# Altium schematic sheet Microcontroller.SchDoc
size A; SheetNumber: 6; SheetTotal: 6
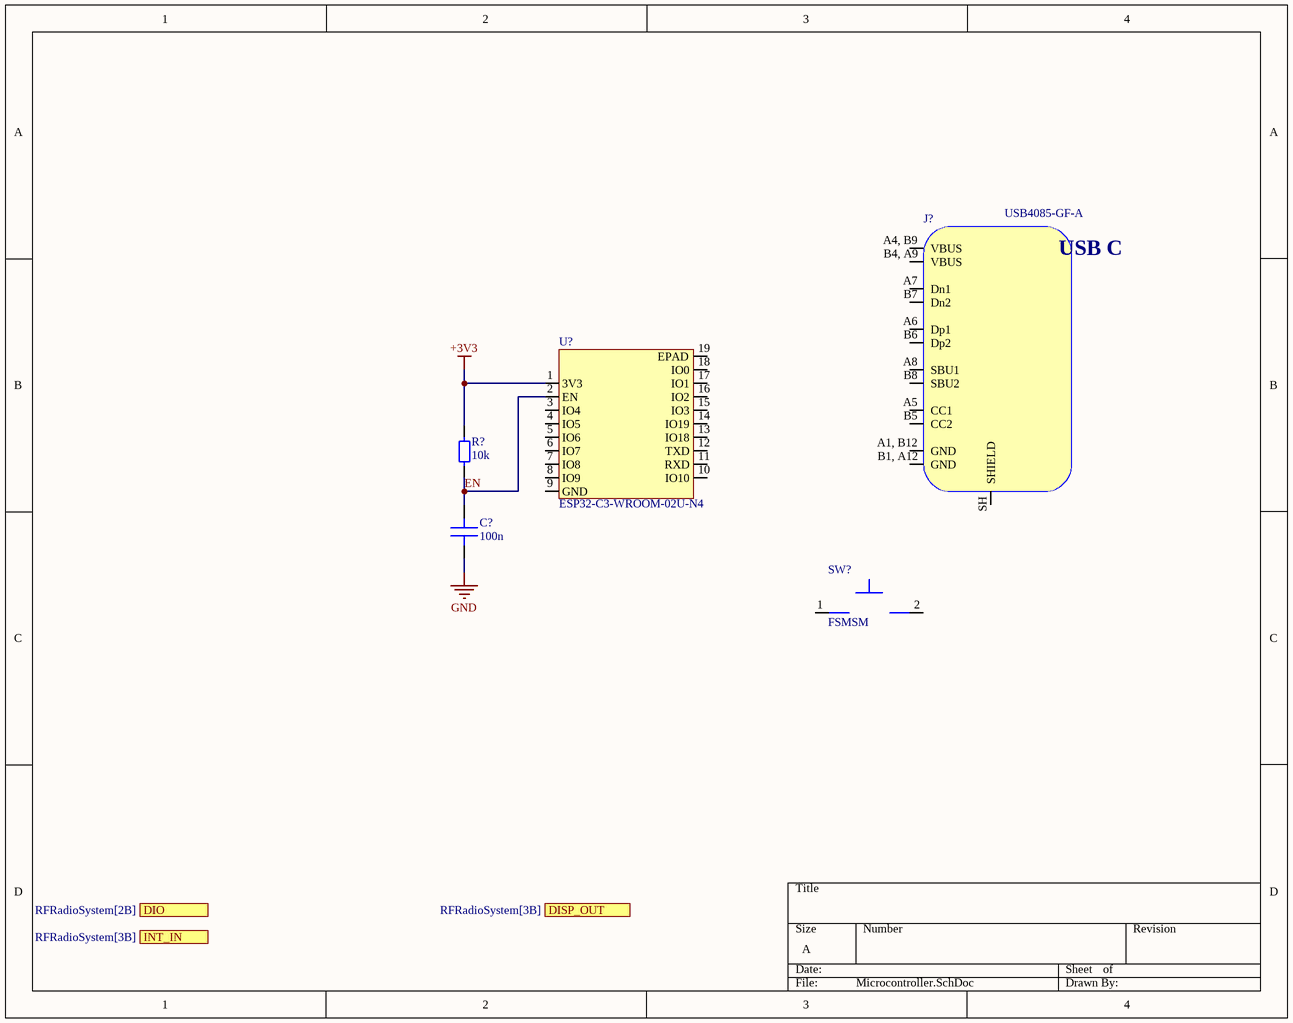
[diagram p0: Microcontroller.SchDoc]

## Parts
C?  100n  [CAP_0603(M)]
J?  USB4085-GF-A
R?  10k  [RES_0603(M)]
SW?  FSMSM  [FSMSM]
U?  ESP32-C3-WROOM-02U-N4  [ESP32-C3-WROOM-02U-N4]

## Ports
DIO (out, see RFRadioSystem[2B]), DISP_OUT (out, see RFRadioSystem[3B]), INT_IN (in, see RFRadioSystem[3B])

## Nets
+3V3: R?.2 U?.1(3V3)
GND: C?.1
EN: C?.2 R?.1 U?.2(EN)

Not connected (* = marked no-connect by the designer): J? A1, B12(GND) A4, B9(VBUS) A5(CC1) A6(Dp1) A7(Dn1) A8(SBU1) B1, A12(GND) B4, A9(VBUS) B5(CC2) B6(Dp2) B7(Dn2) B8(SBU2) SH(SHIELD); SW? 1 2; U? 3(IO4) 4(IO5) 5(IO6) 6(IO7) 7(IO8) 8(IO9) 9(GND) 10(IO10) 11(RXD) 12(TXD) 13(IO18) 14(IO19) 15(IO3) 16(IO2) 17(IO1) 18(IO0) 19(EPAD)

## Notes on the sheet
- (in symbol USB4085-GF-A) USB C

## Library data of the parts
C? = CAP_0603_16V: Capacitor SMD 0603 16V
J? = USB4085-GF-A: USB Connectors USB Type C, 2.0, Rec, TH , G/F, RA , Top Mnt, T & R
R? = RES_0603: Resistor SMD 0603
SW? = FSMSM: SWITCH TACTILE SPST-NO 0.05A 24V
U? = ESP32-C3-WROOM-02U-N4: Bluetooth, WiFi 802.11b/g/n, Bluetooth v5.0 Transceiver Module 2.4GHz Antenna Not Included, U.FL Surface Mount